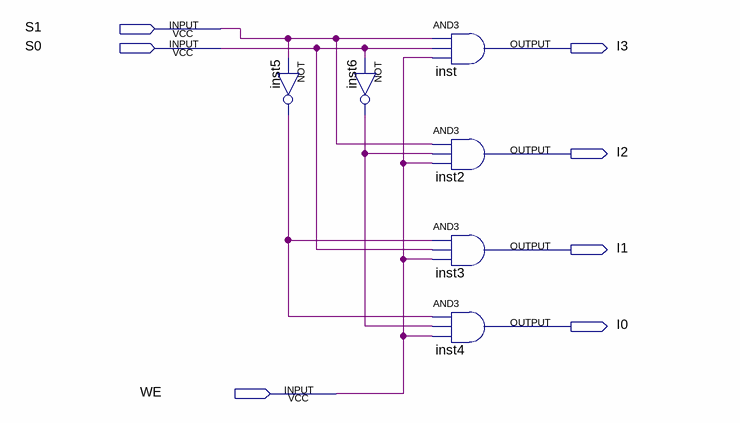
[diagram p0: schematic sheet]
// Quartus schematic Decorder_2bit_to_4bit.bdf as structural Verilog: 6 symbols, 7 pins
module Decorder_2bit_to_4bit (
  input  S1,
  input  S0,
  input  WE,
  output I3,
  output I2,
  output I1,
  output I0
);

  wire inst5_out, inst6_out;

  not inst5 (inst5_out, S1);
  not inst6 (inst6_out, S0);
  and inst (I3, S1, S0, WE);
  and inst2 (I2, S1, inst6_out, WE);
  and inst3 (I1, inst5_out, S0, WE);
  and inst4 (I0, inst5_out, inst6_out, WE);
endmodule
